# EasyEDA Pro project ProDoc_V2.0调参板_2025-08-21.epro

# Schematic Schematic2
Board Name: V2.0调参板; Create Date: 2025-04-02; Page Name: P1; Project Name: 2025双车主板; Schematic Name: Schematic2; Update Date: 2025-04-02; Company: 嘉立创EDA; Page Size: A4; Version: V1.0
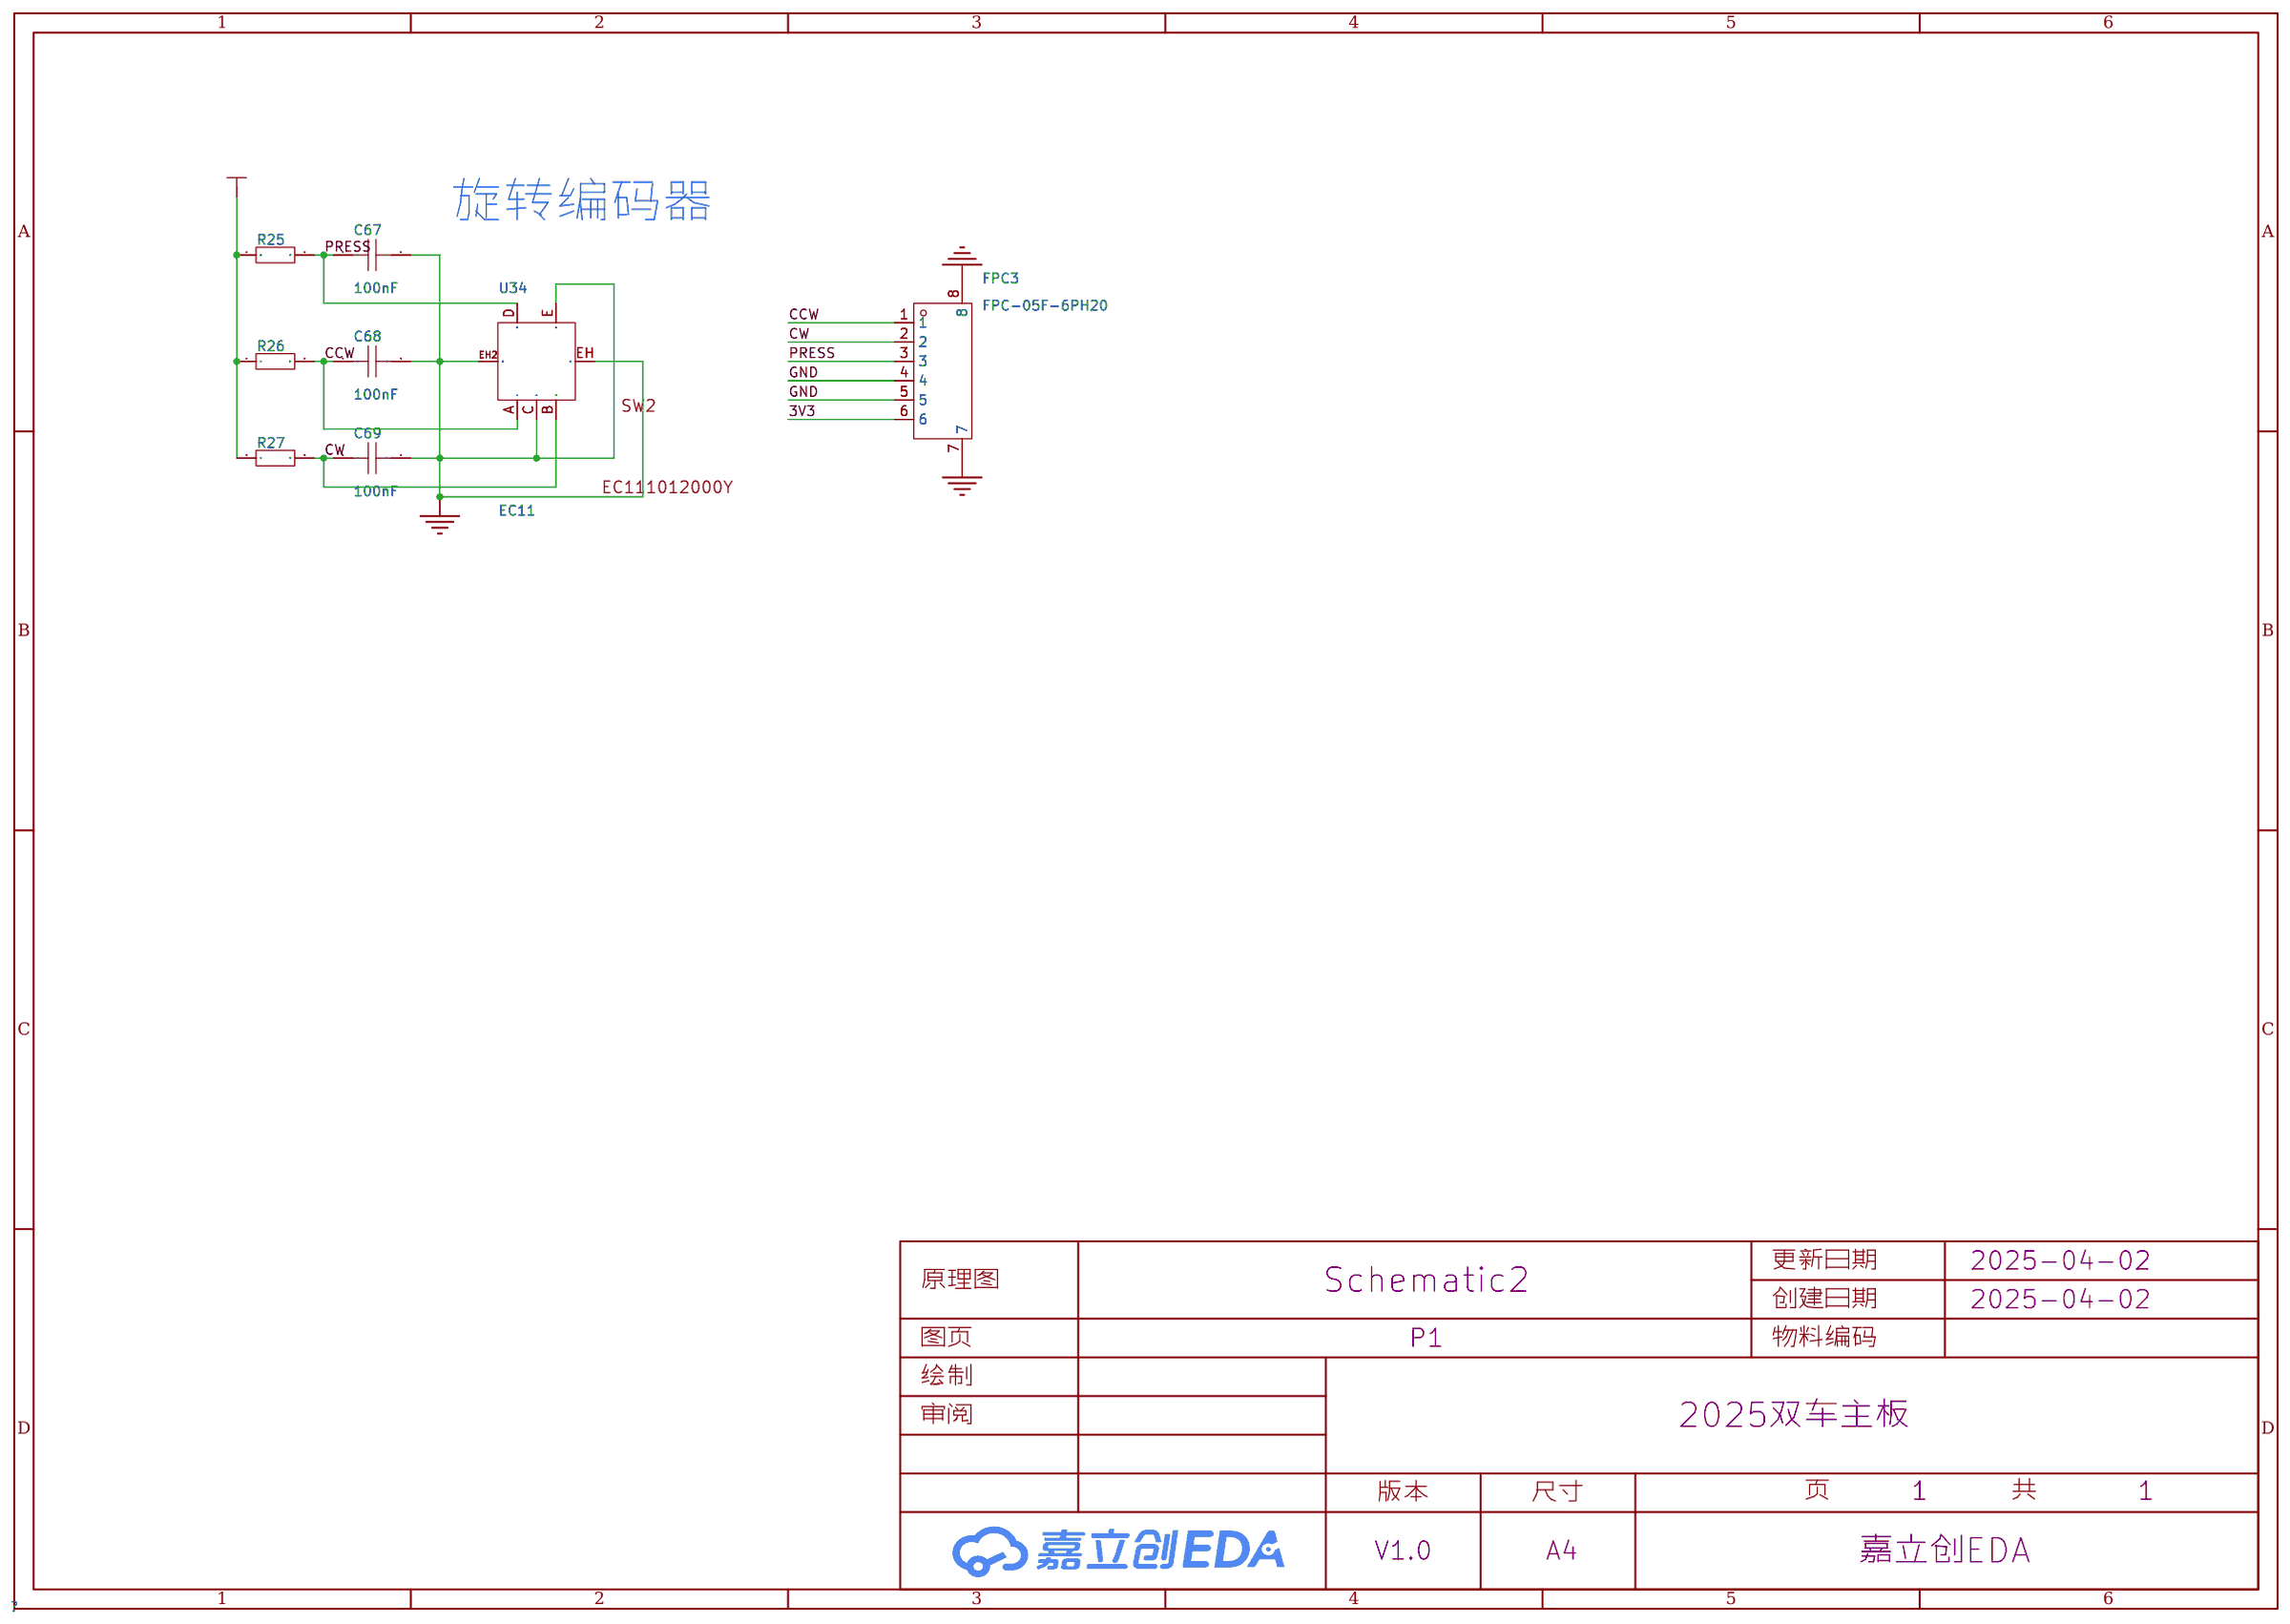
[diagram p0: schematic sheet]

## Parts
C67  100nF  [C0603]
C68  100nF  [C0603]
C69  100nF  [C0603]
FPC3  FPC-05F-6PH20  [FPC-SMD_6P-P0.50_XUNPU_FPC-05F-6PH20]
R25  10kΩ  [R0603]
R26  10kΩ  [R0603]
R27  10kΩ  [R0603]
U34  EC11  [EC11卧式]

## Library data of the parts
C67-C69 = CGA0603X7R104K500JT: 容值:100nF;精度:±10%;额定电压:50V;材质(温度系数):X7R;; LCSC Part Name: 100nF ±10% 50V; Supplier Part: C6119867; Manufacturer: HRE(芯声); Supplier Footprint: 0603; JLCPCB Part Class: 扩展库; Supplier: LCSC; Tolerance: ±10%; Voltage Rated: 50V; Temperature Coefficient: X7R
FPC3 = FPC-05F-6PH20: 锁定特性:翻盖式;触点类型:下接;触点数量:6P;间距:0.5mm;安装类型:卧贴;工作温度范围:-25℃~+85℃;; LCSC Part Name: 间距:0.5mm P数:6P 翻盖式 下接; Supplier Part: C2856796; Manufacturer: XUNPU(讯普); Supplier Footprint: SMD,P=0.5mm,卧贴; JLCPCB Part Class: 扩展库; Datasheet: https://atta.szlcsc.com/upload/public/pdf/source/20210922/16B003FB53336DDF6538142CC465AC4D.pdf; Supplier: LCSC; Locking Feature: 翻盖式; Contact Type: 下接; Number of Contacts: 6P; Pitch: 0.5mm; Mounting Type: 卧贴; FFC, FCB Thickness: 0.3mm; Height Above Board: 2mm; Operating Temperature Range: -25℃~+85℃
R25-R27 = 0603WAF1002T5E: 电阻类型:厚膜电阻;阻值:10kΩ;精度:±1%;功率:100mW;最大工作电压:75V;温度系数:±100ppm/℃;; LCSC Part Name: 厚膜电阻 10kΩ ±1% 100mW; Supplier Part: C25804; Manufacturer: UNI-ROYAL(厚声); Supplier Footprint: 0603; JLCPCB Part Class: 基础库; Datasheet: https://atta.szlcsc.com/upload/public/pdf/source/20200306/C422600_1E6D84923E4A46A82E41ADD87F860B5C.pdf; Supplier: LCSC; Type: 厚膜电阻; Tolerance: ±1%; Power(Watts): 100mW; Overload Voltage (Max): 75V; Temperature Coefficient: ±100ppm/℃; Operating Temperature Range: -55℃~+155℃
U34 = EC11

## Nets
3V3: FPC3.6 R25.1 R26.1 R27.1
GND: C67.2 C68.2 C69.1 FPC3.4 FPC3.5 FPC3.7 FPC3.8 U34.C U34.E U34.EH U34.EH2
CCW: C68.1 FPC3.1 R26.2 U34.A
CW: C69.2 FPC3.2 R27.2 U34.B
PRESS: C67.1 FPC3.3 R25.2 U34.D

## Notes on the sheet
- 旋转编码器

# Board PCB14
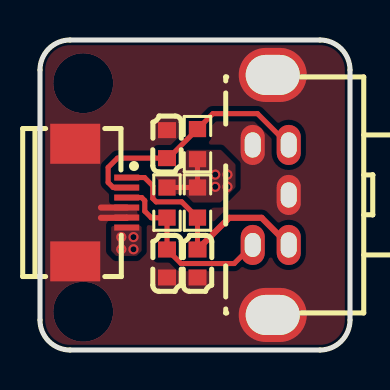
[diagram p1: board, top side]
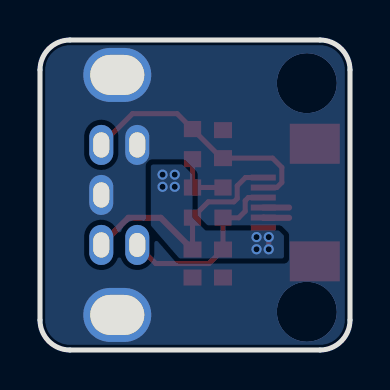
[diagram p2: board, bottom side, seen from below]

Outline 15.5 x 15.5 mm; copper layers: Top Layer, Bottom Layer. Coordinates in mm from the lower left corner of the outline.
Outline path: 0,14 0,1.5 arc(0.44,0.44) 1.5,0 14,0 arc(15.06,0.44) 15.5,1.5 15.5,14 arc(15.06,15.06) 14,15.5 1.5,15.5 arc(0.44,15.06) 0,14
Stack: Top Layer 0.035mm / Dielectric1 1.51mm FR4 er 4.5 / Bottom Layer 0.035mm

## Design rules (mm)
template: 自定义配置
spacing copperThickness1oz (default): track to track 0.102, other pairs 0.152 to 0.3
spacing copperThickness2oz: track to track 0.203, other pairs 0.152 to 0.3
track width copperThickness1oz (default): min 0.127, default 0.254, max 2.54
track width copperThickness2oz: min 0.203, default 0.254, max 2.54
differential pair differentialPair (default): width min 0.127, default 0.254, max 2.54; gap min 0.152, default 0.152
via viaSize (default): diameter min 0.5, default 0.61, max 10; hole min 0.3, default 0.305, max 6.3

## Placement (name value [footprint] x y rotation side)
C67  100nF  [C0603]  6.35 4.32 270 top
C68  100nF  [C0603]  7.87 4.32 270 top
C69  100nF  [C0603]  6.35 10.29 270 top
FPC3  FPC-05F-6PH20  [FPC-SMD_6P-P0.50_XUNPU_FPC-05F-6PH20]  3.05 7.37 270 top
R25  10kΩ  [R0603]  6.35 7.37 270 top
R26  10kΩ  [R0603]  7.87 7.37 270 top
R27  10kΩ  [R0603]  7.87 10.29 90 top
U34  EC11  [EC11卧式]  16.64 7.75 0 top

## Footprints (pads in the part's own frame, mm; a bottom-side part is the same pattern mirrored in y, then rotated)
C0603
  rect 0.8x0.9 smd: 1(-0.7,0) 2(0.7,0)
EC11卧式
  oval 1.2x2 hole 0.8x1.26: A(-4.2,-2.5) B(-4.2,2.5) C(-4.2,0) E(-6,2.5)
  oval 1.2x2 hole 0.8x1.2: D(-6,-2.5)
  oval 3.4x2.7 hole 2.7x2: EH(-5,6) EH2(-5,-6)
FPC-SMD_6P-P0.50_XUNPU_FPC-05F-6PH20
  rect 0.3x1.25 smd: 1(-1.25,1.288) 2(-0.75,1.288) 3(-0.25,1.288) 4(0.25,1.288) 5(0.75,1.288) 6(1.25,1.288)
  rect 2x2.5 smd: 7(2.94,-1.288) 8(-2.94,-1.288)
R0603
  rect 0.806x0.864 smd: 1(-0.753,0) 2(0.753,0)

## Nets
As in the schematic.

## Via types
v1: diameter 3, hole 3, Top Layer to Bottom Layer, 2 vias
v2: diameter 0.508, hole 0.305, Top Layer to Bottom Layer, 8 vias

## Routing (per net, layer and track width the routed paths; a pad name or vN(x,y) marks a point on that pad's centre or on a via; arc(x,y) is an arc through that point)
3V3: length 3.5
  Top Layer w0.254: R27.1 R26.1 R25.1 ; v2(4.06,5.64) v2(4.06,5.04)
  vias: v2(4.67,5.64) v2(4.67,5.04) v2(8.76,8.77) v2(8.76,8.16) v2(9.37,8.77) v2(9.37,8.16)
GND: length 2.6
  Top Layer w0.305: 3.05,6.61 4.32,6.61 FPC3.5 ; FPC3.4 3.05,7.12
  vias: v1(2.16,13.34) v1(2.16,1.91)
CCW: length 12.1
  Top Layer w0.254: FPC3.1 5.23,8.62 5.64,8.21 5.64,7.58 5.81,7.41 7.09,7.41 R26.2 C68.1
  Top Layer w0.305: C68.1 9.46,6.61 11.08,6.61 U34.A
CW: length 12.6
  Top Layer w0.254: FPC3.2 3.66,8.12 3.41,8.38 3.41,9.13 3.87,9.59 C69.2 6.42,9.59 R27.2 8.64,11.82 10.87,11.82 U34.B
PRESS: length 9.3
  Top Layer w0.254: U34.D 9.71,4.32 7.05,4.32 C67.1 R25.2 6.34,6.61 5.57,6.61 5.24,6.94 5.24,7.47 5.08,7.62 FPC3.3

## Copper pours and planes (outline as drawn; the poured copper is in the pictures)
3V3 on Top Layer: 3.56,6.23 3.68,6.36 4.95,6.36 5.08,6.23 5.08,4.96 4.83,4.7 3.81,4.7 3.56,4.96
3V3 on Top Layer: 5.69,8.76 6.6,8.76 7.06,9.21 7.06,9.86 7.21,10.01 9.04,10.01 9.78,9.28 9.78,8.13 9.02,7.37 7.62,7.37 7.49,7.5 6.12,7.5 5.64,7.98 5.64,8.71
3V3 on Bottom Layer: 3.3,5.72 3.56,5.97 7.23,5.97 7.87,6.62 7.87,8.77 8.38,9.28 9.89,9.28 9.95,9.21 9.95,6.22 8.53,4.58 3.3,4.58
GND on Top Layer: -3.18,13.47 -0.13,16.52 15.24,16.52 18.29,13.47 18.29,0.26 15.11,-2.92 0,-2.92 -3.18,0.26
GND on Bottom Layer: -3.56,14.86 -1.52,16.9 15.88,16.9 17.91,14.86 17.91,0.13 15.88,-1.9 -1.27,-1.9 -3.56,0.39
